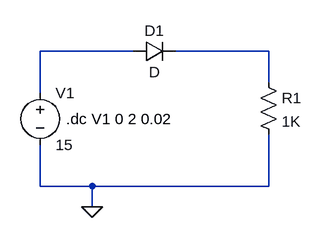
[diagram p0: schematic 4.1.asc]
4.1.asc, the LTspice schematic file:
Version 4
SHEET 1 880 680
WIRE 160 80 16 80
WIRE 368 80 224 80
WIRE 368 128 368 80
WIRE 16 144 16 80
WIRE 16 288 16 224
WIRE 96 288 16 288
WIRE 368 288 368 208
WIRE 368 288 96 288
WIRE 96 320 96 288
FLAG 96 320 0
SYMBOL diode 160 96 R270
WINDOW 0 32 32 VTop 2
WINDOW 3 0 32 VBottom 2
SYMATTR InstName D1
SYMBOL res 352 112 R0
SYMATTR InstName R1
SYMATTR Value 1K
SYMBOL voltage 16 128 R0
WINDOW 123 0 0 Left 0
WINDOW 39 0 0 Left 0
SYMATTR InstName V1
SYMATTR Value 15
TEXT 56 184 Left 2 !.dc V1 0 2 0.02

The netlist it stands for:
* 4.1.asc
D1 N001 N002 D
R1 N002 0 1K
V1 N001 0 15
.model D D
.lib standard.dio
.dc V1 0 2 0.02
.backanno
.end

* Results of the author's LTspice run, read from the files saved beside the schematic
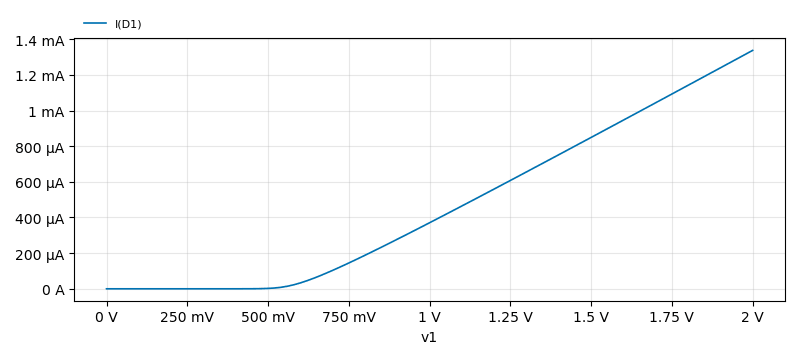
[diagram p1: DC transfer characteristic of 4.1.asc, plotted from the saved traces]
* DC transfer characteristic, 1 run:
*   I(D1): 0 A at v1=0 V, 1.337 mA at v1=2 V, min 0 A, max 1.337 mA